# EAGLE schematic p8x-backplane (EAGLE 9.6.2)
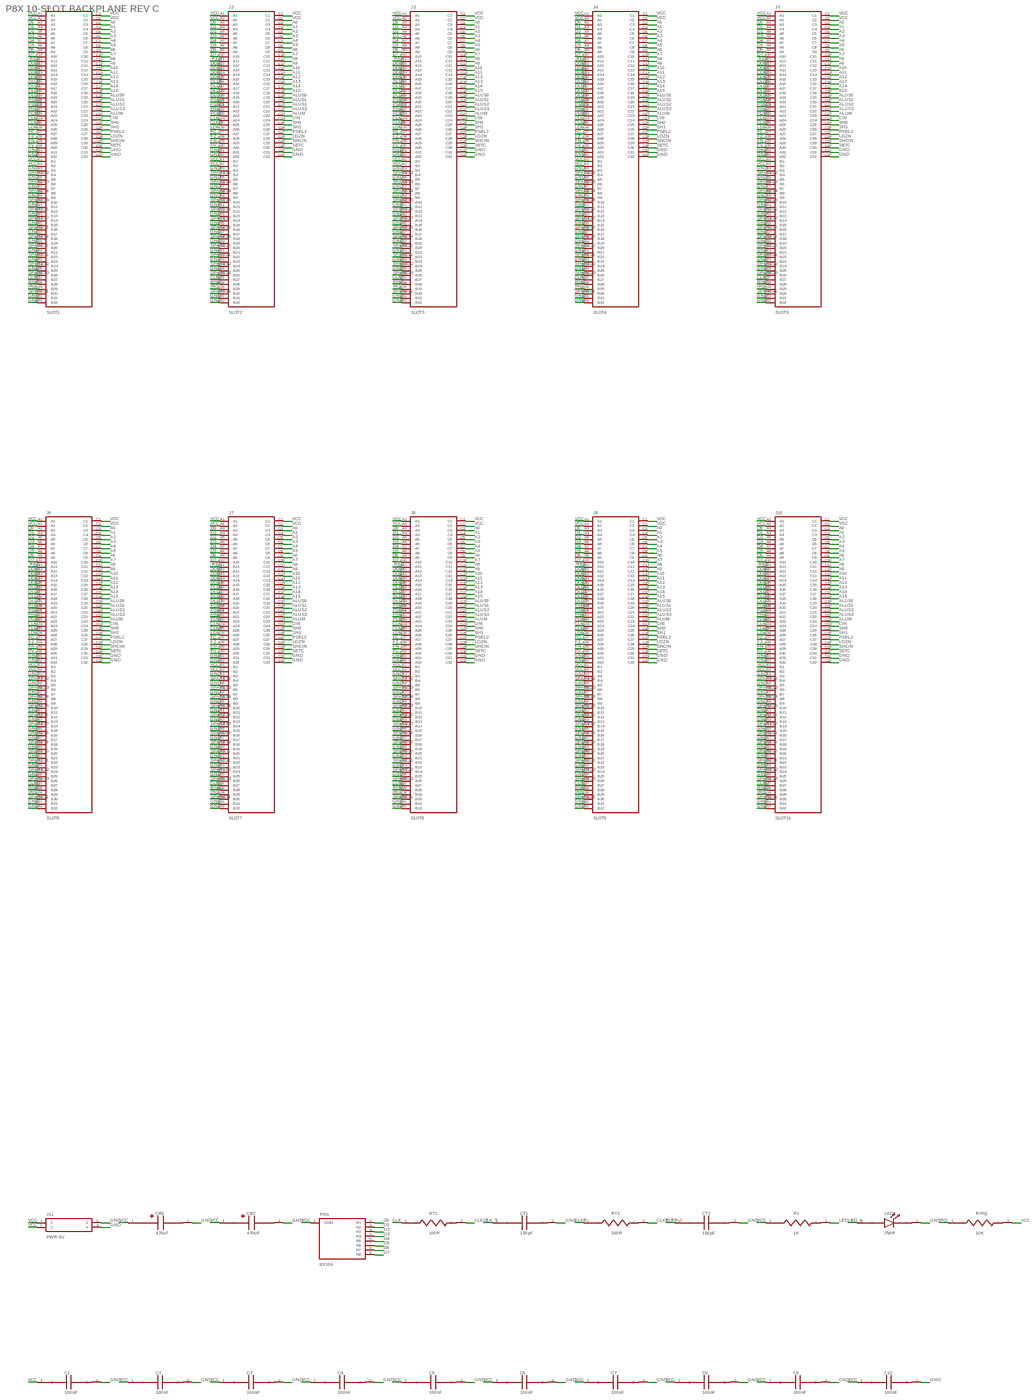
[diagram p0: schematic, sheet 1, overview]
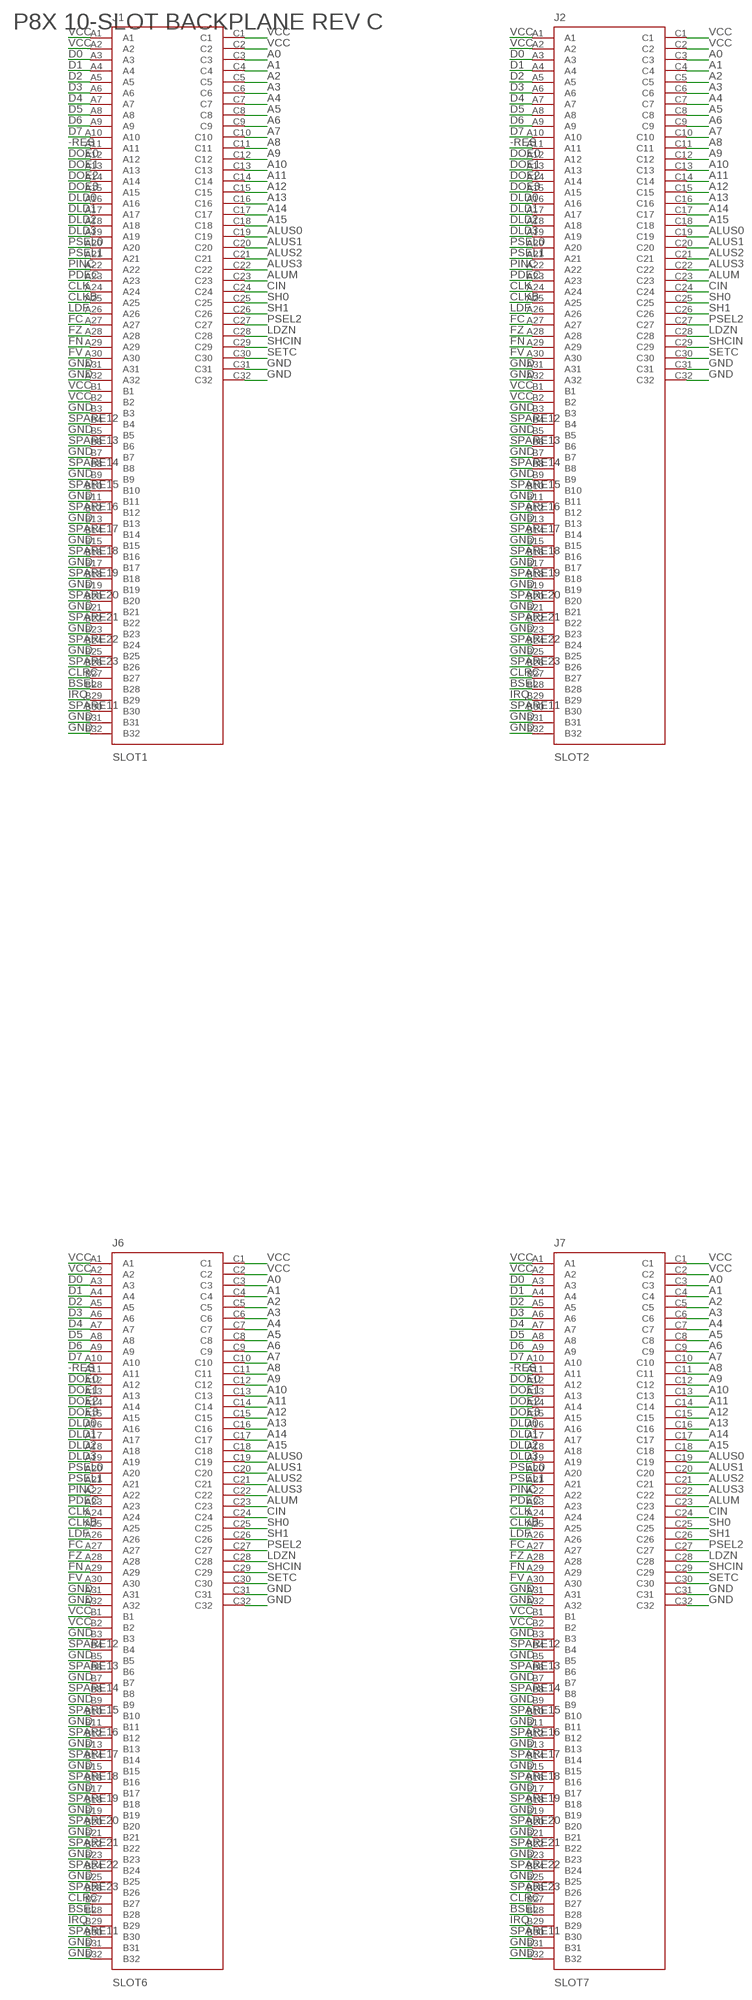
[diagram p1: schematic, sheet 1, part 1 of 4]
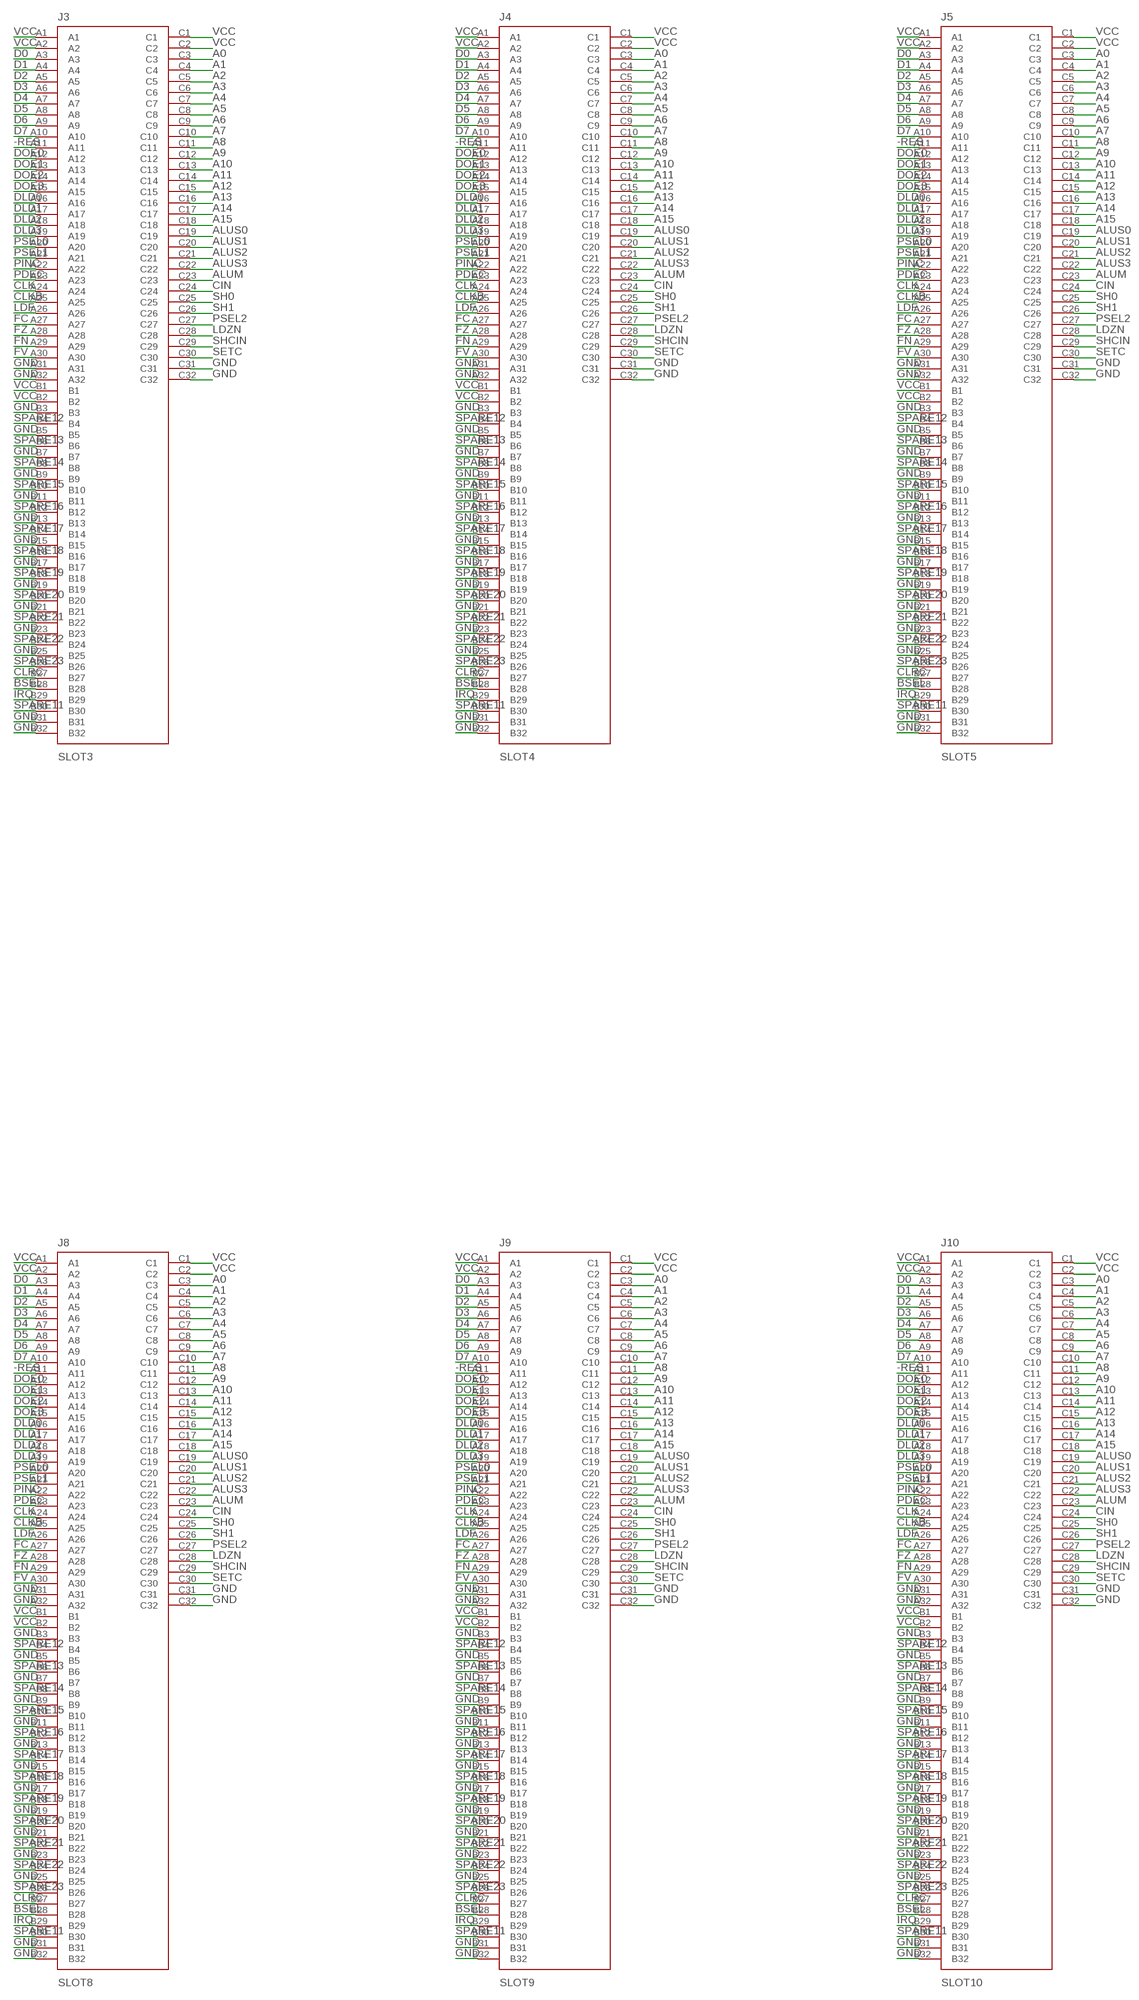
[diagram p2: schematic, sheet 1, part 2 of 4]
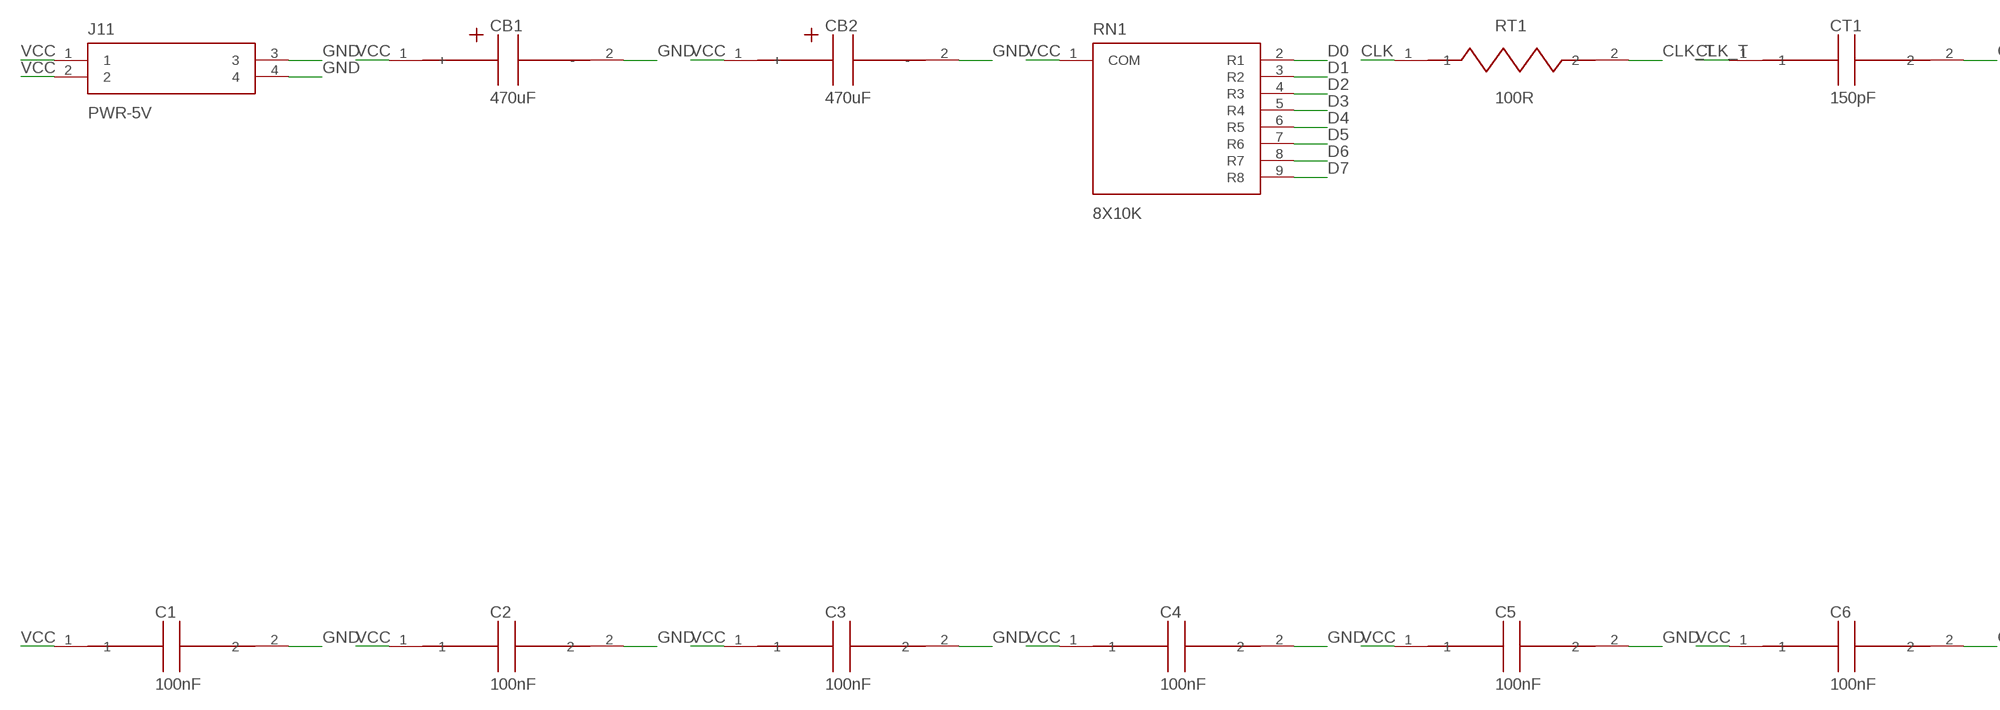
[diagram p3: schematic, sheet 1, part 3 of 4]
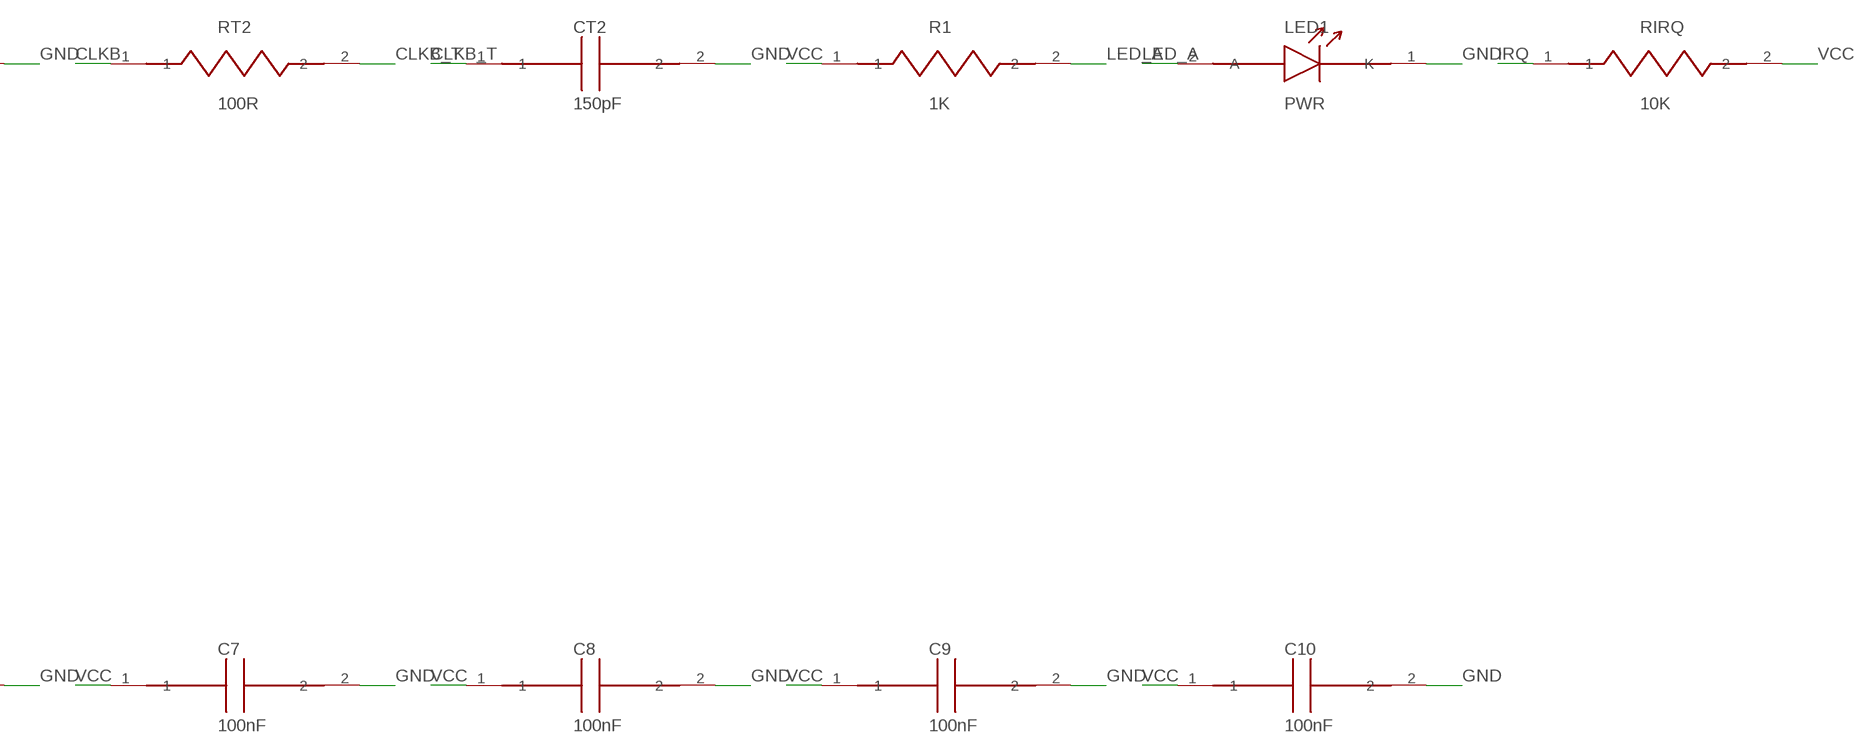
[diagram p4: schematic, sheet 1, part 4 of 4]

## Parts
C1  100nF  CAP1  [C_DISC1]
C2  100nF  CAP1  [C_DISC1]
C3  100nF  CAP1  [C_DISC1]
C4  100nF  CAP1  [C_DISC1]
C5  100nF  CAP1  [C_DISC1]
C6  100nF  CAP1  [C_DISC1]
C7  100nF  CAP1  [C_DISC1]
C8  100nF  CAP1  [C_DISC1]
C9  100nF  CAP1  [C_DISC1]
C10  100nF  CAP1  [C_DISC1]
CB1  470uF  CAPP  [CP_RADIAL]
CB2  470uF  CAPP  [CP_RADIAL]
CT1  150pF  CAP  [C_DISC]
CT2  150pF  CAP  [C_DISC]
J1  SLOT1  DIN96  [FABC96S]
J2  SLOT2  DIN96  [FABC96S]
J3  SLOT3  DIN96  [FABC96S]
J4  SLOT4  DIN96  [FABC96S]
J5  SLOT5  DIN96  [FABC96S]
J6  SLOT6  DIN96  [FABC96S]
J7  SLOT7  DIN96  [FABC96S]
J8  SLOT8  DIN96  [FABC96S]
J9  SLOT9  DIN96  [FABC96S]
J10  SLOT10  DIN96  [FABC96S]
J11  PWR-5V  TB4  [TB4]
LED1  PWR  LED  [LED5]
R1  1K  RES  [R_AXIAL]
RIRQ  10K  RES  [R_AXIAL]
RN1  8X10K  SIP9  [SIP9]
RT1  100R  RES  [R_AXIAL]
RT2  100R  RES  [R_AXIAL]

## Nets
-RES: J1.A11 J2.A11 J3.A11 J4.A11 J5.A11 J6.A11 J7.A11 J8.A11 J9.A11 J10.A11
A0: J1.C3 J2.C3 J3.C3 J4.C3 J5.C3 J6.C3 J7.C3 J8.C3 J9.C3 J10.C3
A1: J1.C4 J2.C4 J3.C4 J4.C4 J5.C4 J6.C4 J7.C4 J8.C4 J9.C4 J10.C4
A2: J1.C5 J2.C5 J3.C5 J4.C5 J5.C5 J6.C5 J7.C5 J8.C5 J9.C5 J10.C5
A3: J1.C6 J2.C6 J3.C6 J4.C6 J5.C6 J6.C6 J7.C6 J8.C6 J9.C6 J10.C6
A4: J1.C7 J2.C7 J3.C7 J4.C7 J5.C7 J6.C7 J7.C7 J8.C7 J9.C7 J10.C7
A5: J1.C8 J2.C8 J3.C8 J4.C8 J5.C8 J6.C8 J7.C8 J8.C8 J9.C8 J10.C8
A6: J1.C9 J2.C9 J3.C9 J4.C9 J5.C9 J6.C9 J7.C9 J8.C9 J9.C9 J10.C9
A7: J1.C10 J2.C10 J3.C10 J4.C10 J5.C10 J6.C10 J7.C10 J8.C10 J9.C10 J10.C10
A8: J1.C11 J2.C11 J3.C11 J4.C11 J5.C11 J6.C11 J7.C11 J8.C11 J9.C11 J10.C11
A9: J1.C12 J2.C12 J3.C12 J4.C12 J5.C12 J6.C12 J7.C12 J8.C12 J9.C12 J10.C12
A10: J1.C13 J2.C13 J3.C13 J4.C13 J5.C13 J6.C13 J7.C13 J8.C13 J9.C13 J10.C13
A11: J1.C14 J2.C14 J3.C14 J4.C14 J5.C14 J6.C14 J7.C14 J8.C14 J9.C14 J10.C14
A12: J1.C15 J2.C15 J3.C15 J4.C15 J5.C15 J6.C15 J7.C15 J8.C15 J9.C15 J10.C15
A13: J1.C16 J2.C16 J3.C16 J4.C16 J5.C16 J6.C16 J7.C16 J8.C16 J9.C16 J10.C16
A14: J1.C17 J2.C17 J3.C17 J4.C17 J5.C17 J6.C17 J7.C17 J8.C17 J9.C17 J10.C17
A15: J1.C18 J2.C18 J3.C18 J4.C18 J5.C18 J6.C18 J7.C18 J8.C18 J9.C18 J10.C18
ALUM: J1.C23 J2.C23 J3.C23 J4.C23 J5.C23 J6.C23 J7.C23 J8.C23 J9.C23 J10.C23
ALUS0: J1.C19 J2.C19 J3.C19 J4.C19 J5.C19 J6.C19 J7.C19 J8.C19 J9.C19 J10.C19
ALUS1: J1.C20 J2.C20 J3.C20 J4.C20 J5.C20 J6.C20 J7.C20 J8.C20 J9.C20 J10.C20
ALUS2: J1.C21 J2.C21 J3.C21 J4.C21 J5.C21 J6.C21 J7.C21 J8.C21 J9.C21 J10.C21
ALUS3: J1.C22 J2.C22 J3.C22 J4.C22 J5.C22 J6.C22 J7.C22 J8.C22 J9.C22 J10.C22
BSEL: J1.B28 J2.B28 J3.B28 J4.B28 J5.B28 J6.B28 J7.B28 J8.B28 J9.B28 J10.B28
CIN: J1.C24 J2.C24 J3.C24 J4.C24 J5.C24 J6.C24 J7.C24 J8.C24 J9.C24 J10.C24
CLK: J1.A24 J2.A24 J3.A24 J4.A24 J5.A24 J6.A24 J7.A24 J8.A24 J9.A24 J10.A24 RT1.1
CLK_T: CT1.1 RT1.2
CLKB: J1.A25 J2.A25 J3.A25 J4.A25 J5.A25 J6.A25 J7.A25 J8.A25 J9.A25 J10.A25 RT2.1
CLKB_T: CT2.1 RT2.2
CLRC: J1.B27 J2.B27 J3.B27 J4.B27 J5.B27 J6.B27 J7.B27 J8.B27 J9.B27 J10.B27
D0: J1.A3 J2.A3 J3.A3 J4.A3 J5.A3 J6.A3 J7.A3 J8.A3 J9.A3 J10.A3 RN1.2(R1)
D1: J1.A4 J2.A4 J3.A4 J4.A4 J5.A4 J6.A4 J7.A4 J8.A4 J9.A4 J10.A4 RN1.3(R2)
D2: J1.A5 J2.A5 J3.A5 J4.A5 J5.A5 J6.A5 J7.A5 J8.A5 J9.A5 J10.A5 RN1.4(R3)
D3: J1.A6 J2.A6 J3.A6 J4.A6 J5.A6 J6.A6 J7.A6 J8.A6 J9.A6 J10.A6 RN1.5(R4)
D4: J1.A7 J2.A7 J3.A7 J4.A7 J5.A7 J6.A7 J7.A7 J8.A7 J9.A7 J10.A7 RN1.6(R5)
D5: J1.A8 J2.A8 J3.A8 J4.A8 J5.A8 J6.A8 J7.A8 J8.A8 J9.A8 J10.A8 RN1.7(R6)
D6: J1.A9 J2.A9 J3.A9 J4.A9 J5.A9 J6.A9 J7.A9 J8.A9 J9.A9 J10.A9 RN1.8(R7)
D7: J1.A10 J2.A10 J3.A10 J4.A10 J5.A10 J6.A10 J7.A10 J8.A10 J9.A10 J10.A10 RN1.9(R8)
DLD0: J1.A16 J2.A16 J3.A16 J4.A16 J5.A16 J6.A16 J7.A16 J8.A16 J9.A16 J10.A16
DLD1: J1.A17 J2.A17 J3.A17 J4.A17 J5.A17 J6.A17 J7.A17 J8.A17 J9.A17 J10.A17
DLD2: J1.A18 J2.A18 J3.A18 J4.A18 J5.A18 J6.A18 J7.A18 J8.A18 J9.A18 J10.A18
DLD3: J1.A19 J2.A19 J3.A19 J4.A19 J5.A19 J6.A19 J7.A19 J8.A19 J9.A19 J10.A19
DOE0: J1.A12 J2.A12 J3.A12 J4.A12 J5.A12 J6.A12 J7.A12 J8.A12 J9.A12 J10.A12
DOE1: J1.A13 J2.A13 J3.A13 J4.A13 J5.A13 J6.A13 J7.A13 J8.A13 J9.A13 J10.A13
DOE2: J1.A14 J2.A14 J3.A14 J4.A14 J5.A14 J6.A14 J7.A14 J8.A14 J9.A14 J10.A14
DOE3: J1.A15 J2.A15 J3.A15 J4.A15 J5.A15 J6.A15 J7.A15 J8.A15 J9.A15 J10.A15
FC: J1.A27 J2.A27 J3.A27 J4.A27 J5.A27 J6.A27 J7.A27 J8.A27 J9.A27 J10.A27
FN: J1.A29 J2.A29 J3.A29 J4.A29 J5.A29 J6.A29 J7.A29 J8.A29 J9.A29 J10.A29
FV: J1.A30 J2.A30 J3.A30 J4.A30 J5.A30 J6.A30 J7.A30 J8.A30 J9.A30 J10.A30
FZ: J1.A28 J2.A28 J3.A28 J4.A28 J5.A28 J6.A28 J7.A28 J8.A28 J9.A28 J10.A28
GND: C1.2 C2.2 C3.2 C4.2 C5.2 C6.2 C7.2 C8.2 C9.2 C10.2 CB1.2(-) CB2.2(-) CT1.2 CT2.2 J1.A31 J1.A32 J1.B3 J1.B5 J1.B7 J1.B9 J1.B11 J1.B13 J1.B15 J1.B17 J1.B19 J1.B21 J1.B23 J1.B25 J1.B31 J1.B32 J1.C31 J1.C32 J2.A31 J2.A32 J2.B3 J2.B5 J2.B7 J2.B9 J2.B11 J2.B13 J2.B15 J2.B17 J2.B19 J2.B21 J2.B23 J2.B25 J2.B31 J2.B32 J2.C31 J2.C32 J3.A31 J3.A32 J3.B3 J3.B5 J3.B7 J3.B9 J3.B11 J3.B13 J3.B15 J3.B17 J3.B19 J3.B21 J3.B23 J3.B25 J3.B31 J3.B32 J3.C31 J3.C32 J4.A31 J4.A32 J4.B3 J4.B5 J4.B7 J4.B9 J4.B11 J4.B13 J4.B15 J4.B17 J4.B19 J4.B21 J4.B23 J4.B25 J4.B31 J4.B32 J4.C31 J4.C32 J5.A31 J5.A32 J5.B3 J5.B5 J5.B7 J5.B9 J5.B11 J5.B13 J5.B15 J5.B17 J5.B19 J5.B21 J5.B23 J5.B25 J5.B31 J5.B32 J5.C31 J5.C32 J6.A31 J6.A32 J6.B3 J6.B5 J6.B7 J6.B9 J6.B11 J6.B13 J6.B15 J6.B17 J6.B19 J6.B21 J6.B23 J6.B25 J6.B31 J6.B32 J6.C31 J6.C32 J7.A31 J7.A32 J7.B3 J7.B5 J7.B7 J7.B9 J7.B11 J7.B13 J7.B15 J7.B17 J7.B19 J7.B21 J7.B23 J7.B25 J7.B31 J7.B32 J7.C31 J7.C32 J8.A31 J8.A32 J8.B3 J8.B5 J8.B7 J8.B9 J8.B11 J8.B13 J8.B15 J8.B17 J8.B19 J8.B21 J8.B23 J8.B25 J8.B31 J8.B32 J8.C31 J8.C32 J9.A31 J9.A32 J9.B3 J9.B5 J9.B7 J9.B9 J9.B11 J9.B13 J9.B15 J9.B17 J9.B19 J9.B21 J9.B23 J9.B25 J9.B31 J9.B32 J9.C31 J9.C32 J10.A31 J10.A32 J10.B3 J10.B5 J10.B7 J10.B9 J10.B11 J10.B13 J10.B15 J10.B17 J10.B19 J10.B21 J10.B23 J10.B25 J10.B31 J10.B32 J10.C31 J10.C32 J11.3 J11.4 LED1.1(K)
IRQ: J1.B29 J2.B29 J3.B29 J4.B29 J5.B29 J6.B29 J7.B29 J8.B29 J9.B29 J10.B29 RIRQ.1
LDF: J1.A26 J2.A26 J3.A26 J4.A26 J5.A26 J6.A26 J7.A26 J8.A26 J9.A26 J10.A26
LDZN: J1.C28 J2.C28 J3.C28 J4.C28 J5.C28 J6.C28 J7.C28 J8.C28 J9.C28 J10.C28
LED_A: LED1.2(A) R1.2
PDEC: J1.A23 J2.A23 J3.A23 J4.A23 J5.A23 J6.A23 J7.A23 J8.A23 J9.A23 J10.A23
PINC: J1.A22 J2.A22 J3.A22 J4.A22 J5.A22 J6.A22 J7.A22 J8.A22 J9.A22 J10.A22
PSEL0: J1.A20 J2.A20 J3.A20 J4.A20 J5.A20 J6.A20 J7.A20 J8.A20 J9.A20 J10.A20
PSEL1: J1.A21 J2.A21 J3.A21 J4.A21 J5.A21 J6.A21 J7.A21 J8.A21 J9.A21 J10.A21
PSEL2: J1.C27 J2.C27 J3.C27 J4.C27 J5.C27 J6.C27 J7.C27 J8.C27 J9.C27 J10.C27
SETC: J1.C30 J2.C30 J3.C30 J4.C30 J5.C30 J6.C30 J7.C30 J8.C30 J9.C30 J10.C30
SH0: J1.C25 J2.C25 J3.C25 J4.C25 J5.C25 J6.C25 J7.C25 J8.C25 J9.C25 J10.C25
SH1: J1.C26 J2.C26 J3.C26 J4.C26 J5.C26 J6.C26 J7.C26 J8.C26 J9.C26 J10.C26
SHCIN: J1.C29 J2.C29 J3.C29 J4.C29 J5.C29 J6.C29 J7.C29 J8.C29 J9.C29 J10.C29
SPARE11: J1.B30 J2.B30 J3.B30 J4.B30 J5.B30 J6.B30 J7.B30 J8.B30 J9.B30 J10.B30
SPARE12: J1.B4 J2.B4 J3.B4 J4.B4 J5.B4 J6.B4 J7.B4 J8.B4 J9.B4 J10.B4
SPARE13: J1.B6 J2.B6 J3.B6 J4.B6 J5.B6 J6.B6 J7.B6 J8.B6 J9.B6 J10.B6
SPARE14: J1.B8 J2.B8 J3.B8 J4.B8 J5.B8 J6.B8 J7.B8 J8.B8 J9.B8 J10.B8
SPARE15: J1.B10 J2.B10 J3.B10 J4.B10 J5.B10 J6.B10 J7.B10 J8.B10 J9.B10 J10.B10
SPARE16: J1.B12 J2.B12 J3.B12 J4.B12 J5.B12 J6.B12 J7.B12 J8.B12 J9.B12 J10.B12
SPARE17: J1.B14 J2.B14 J3.B14 J4.B14 J5.B14 J6.B14 J7.B14 J8.B14 J9.B14 J10.B14
SPARE18: J1.B16 J2.B16 J3.B16 J4.B16 J5.B16 J6.B16 J7.B16 J8.B16 J9.B16 J10.B16
SPARE19: J1.B18 J2.B18 J3.B18 J4.B18 J5.B18 J6.B18 J7.B18 J8.B18 J9.B18 J10.B18
SPARE20: J1.B20 J2.B20 J3.B20 J4.B20 J5.B20 J6.B20 J7.B20 J8.B20 J9.B20 J10.B20
SPARE21: J1.B22 J2.B22 J3.B22 J4.B22 J5.B22 J6.B22 J7.B22 J8.B22 J9.B22 J10.B22
SPARE22: J1.B24 J2.B24 J3.B24 J4.B24 J5.B24 J6.B24 J7.B24 J8.B24 J9.B24 J10.B24
SPARE23: J1.B26 J2.B26 J3.B26 J4.B26 J5.B26 J6.B26 J7.B26 J8.B26 J9.B26 J10.B26
VCC: C1.1 C2.1 C3.1 C4.1 C5.1 C6.1 C7.1 C8.1 C9.1 C10.1 CB1.1(+) CB2.1(+) J1.A1 J1.A2 J1.B1 J1.B2 J1.C1 J1.C2 J2.A1 J2.A2 J2.B1 J2.B2 J2.C1 J2.C2 J3.A1 J3.A2 J3.B1 J3.B2 J3.C1 J3.C2 J4.A1 J4.A2 J4.B1 J4.B2 J4.C1 J4.C2 J5.A1 J5.A2 J5.B1 J5.B2 J5.C1 J5.C2 J6.A1 J6.A2 J6.B1 J6.B2 J6.C1 J6.C2 J7.A1 J7.A2 J7.B1 J7.B2 J7.C1 J7.C2 J8.A1 J8.A2 J8.B1 J8.B2 J8.C1 J8.C2 J9.A1 J9.A2 J9.B1 J9.B2 J9.C1 J9.C2 J10.A1 J10.A2 J10.B1 J10.B2 J10.C1 J10.C2 J11.1 J11.2 R1.1 RIRQ.2 RN1.1(COM)

## Notes on the sheet
- P8X 10-SLOT BACKPLANE REV C

## Library data of the parts
C1-C10 = p8x:CAP1
CB1 CB2 = p8x:CAPP
CT1 CT2 = p8x:CAP
J1-J10 = p8x:DIN96
J11 = p8x:TB4
LED1 = p8x:LED
R1 RIRQ RT1 RT2 = p8x:RES
RN1 = p8x:SIP9